# EAGLE design rp2040BOY (EAGLE 9.6.2)
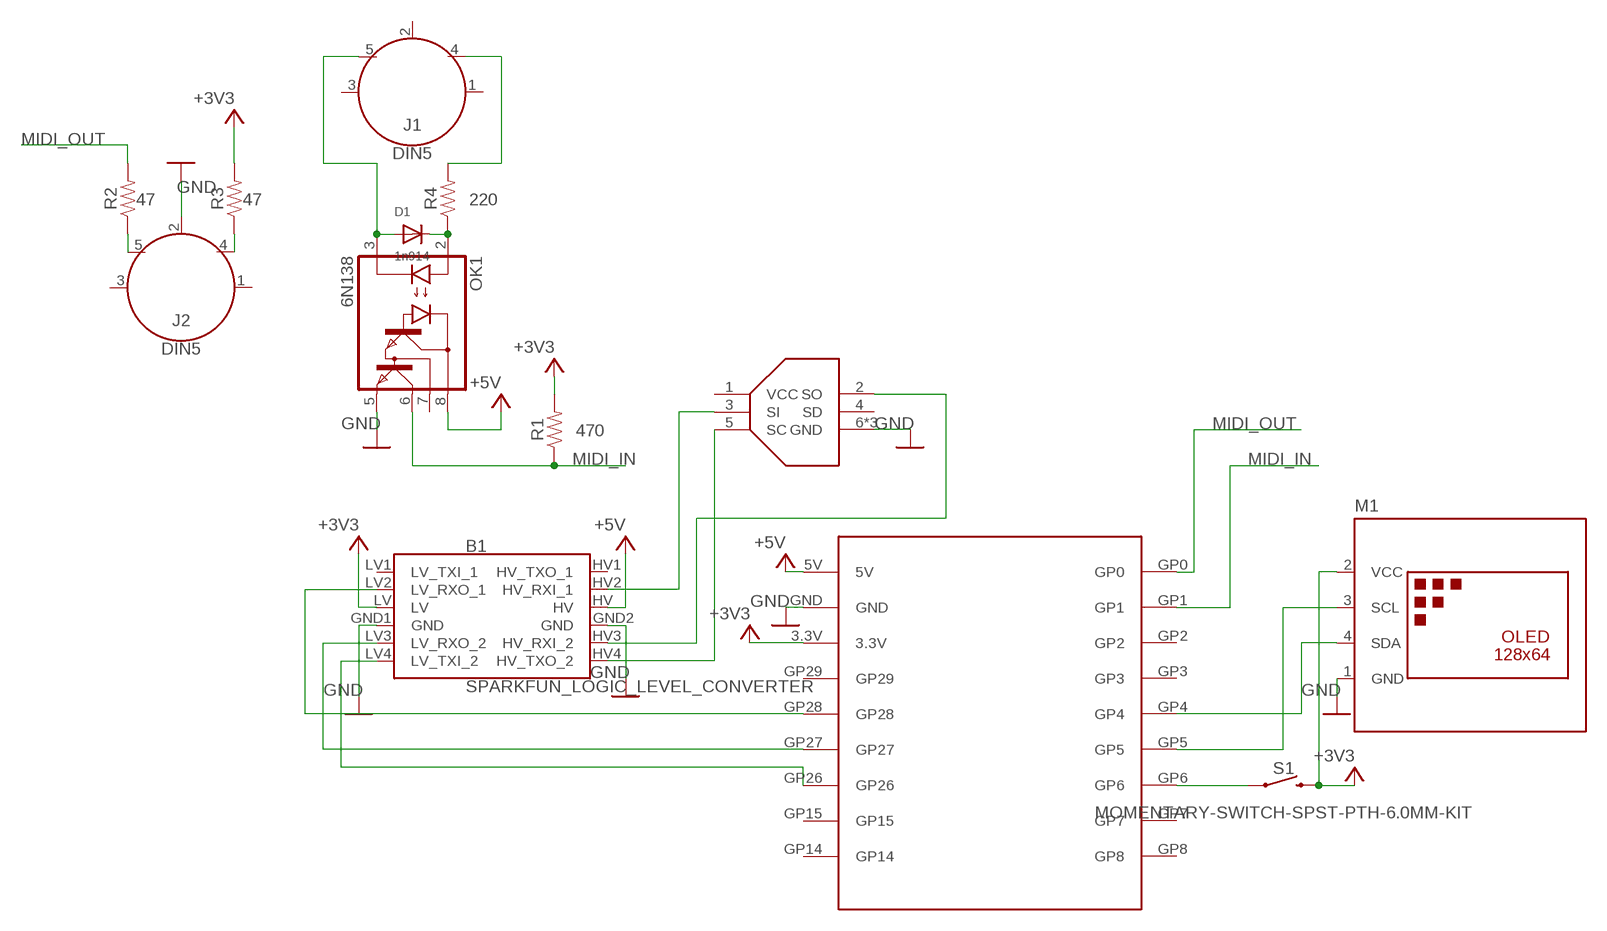
[diagram p0: schematic, sheet 1]

## Parts
B1  SPARKFUN_LOGIC_LEVEL_CONVERTER  [SPARKFUN_LOGIC_LEVEL_CONVERTER]
D1  1n914  DIODEDO-1N4148  [DO-1N4148]
J1  DIN5  [DIN5-RA-PTH]
J2  DIN5  [DIN5-RA-PTH]
M1  OLED-128X64-I2C-NH  [DISPLAY-OLED-128X64-I2C_NH]
OK1  6N138  [DIL08]
R1  470  RESISTORAXIAL-0.3  [AXIAL-0.3]
R2  47  RESISTORAXIAL-0.3  [AXIAL-0.3]
R3  47  RESISTORAXIAL-0.3  [AXIAL-0.3]
R4  220  RESISTORAXIAL-0.3  [AXIAL-0.3]
S1  MOMENTARY-SWITCH-SPST-PTH-6.0MM-KIT  [TACTILE_SWITCH_PTH_6.0MM_KIT]
U$1  GBC_LINK_CONN  [GBC]
U$2  RP2040-ZERO-ROUND  [RP2040-ZERO_O]

## Nets
+3V3: B1.LV M1.2(VCC) R1.P$2 R3.P$2 S1.3 U$2.3.3V
+5V: B1.HV OK1.8(VCC) U$2.5V
GND: B1.GND1(GND) B1.GND2(GND) J2.2 M1.1(GND) OK1.5(GND) U$1.6(GND) U$1.P$7(GND) U$1.P$8(GND) U$2.GND
MIDI_IN: OK1.6(VO) R1.P$1 U$2.GP1
MIDI_OUT: R2.P$2 U$2.GP0
N$1: B1.LV4(LV_TXI_2) U$2.GP26
N$2: B1.LV3(LV_RXO_2) U$2.GP27
N$3: B1.LV2(LV_RXO_1) U$2.GP28
N$4: B1.HV3(HV_RXI_2) U$1.2(SO)
N$5: B1.HV2(HV_RXI_1) U$1.3(SI)
N$6: B1.HV4(HV_TXO_2) U$1.5(SC)
N$7: S1.1 U$2.GP6
N$8: M1.4(SDA) U$2.GP4
N$9: M1.3(SCL) U$2.GP5
N$10: D1.A J1.5 OK1.3(C)
N$11: D1.C OK1.2(A) R4.P$1
N$13: J2.5 R2.P$1
N$14: J2.4 R3.P$1
N$15: J1.4 R4.P$2
Unconnected: B1.HV1(HV_TXO_1) B1.LV1(LV_TXI_1) J1.1 J1.2 J1.3 J2.1 J2.3 OK1.7(VB) U$1.1(VCC) U$1.4(SD) U$2.GP2 U$2.GP3 U$2.GP7 U$2.GP8 U$2.GP14 U$2.GP15 U$2.GP29

## Library data of the parts
B1 = SparkFun-Boards:SPARKFUN_LOGIC_LEVEL_CONVERTER: SparkFun Logic Level Converter -Bi-Directional This is the mechnical outline for the 3.3V - 5V bi directional logic level converter. *Note, the "LOCK" Package has the header pins staggered by an offset of 5 mils (off center line), so that when you slide a row of standard 0.1" headers into the PTH pads, it will hold position vertically. See the follwing turorial for more information on this type of special footprints: Sneaky Footprints <https://www.sparkfun.com/tutorials/114> SparkFun Products: SparkFun Logic Level Converter - Bi-Directional <https://www.sparkfun.com/products/12009>
D1 = adafruit:DIODE: Diode SMADIODE - SMA Surface Mount Package 20V 1A Schottky Diode Digikey: 641-1014-6-ND DO-1N4148 - Through Hole Small Current Diode SOD-123 20V 1 A (.5mV Vf) Schottky Diode - Digikey: MBRX120TPMSCT-ND SOD-323 10V 570mA (.38mV Vf, 3ns) Schottky Diode - Digikey: ZLLS410CT-ND SOD-523 30V 30mA Schottky Diode (RB751S-40TE61) - Digikey: RB751S-40TE61CT-ND SOT23-R/W - SOT23 Package (R = Solder Paste/Reflow Ovens, W = Hand-Soldering) BAT54Film 40V 300mA - Digikey: 497-7162-1-ND
J1 J2 = SparkFun-Connectors:DIN5: DIN5 Connector - Female Right Angle (frequently used as a MIDI Jack connector) This type of connector and cable is frequently used for transmitting midi data (musical instrument digital interface). It is what you usually see on a keyboard or set of electronic drums. Learn more here <https://en.wikipedia.org/wiki/MIDI>. For more information on the pinout and electrical specifications of MIDI communications, please see the following resource: https://www.midi.org/specifications/item/midi-din-electrical-specification Here is the connector we sell at SparkFun: MIDI Connector - Female Right Angle <https://www.sparkfun.com/products/9536> (PRT-09536) Datasheet <hhttp://www.sparkfun.com/datasheets/Prototyping/Connectors/MIDI-RA.pdf> It is used on this SparkFun product: SparkFun MIDI Shield <https://www.sparkfun.com/products/12898> (DEV-12898); PROD_ID: CONN-09481
M1 = MCE_Displays:OLED-128X64-I2C: 128x64 Dot Matrix OLED Module based on SSD1306/SSD1309 chip Variant with I2C interface
OK1 = optocoupler:6N138: MOTOROLA OPTO COUPLER; MF: VISHAY/TELEFUNKEN; MPN: 6N138; OC_FARNELL: 9860150; OC_NEWARK: 35K5294
R1-R4 = SparkFun-Resistors:RESISTOR: Generic Resistor Package
S1 = SparkFun-Switches:MOMENTARY-SWITCH-SPST: Momentary Switch (Pushbutton) - SPST Normally-open (NO) SPST momentary switches (buttons, pushbuttons). Variants PTH-12MM - 12mm square, through-hole Momentary Pushbutton Switch - 12mm Square <https://www.sparkfun.com/products/9190> (COM-09190) PTH-6.0MM, PTH-6.0MM-KIT - 6.0mm square, through-hole Mini Pushbutton Switch <https://www.sparkfun.com/products/97> (COM-00097) KIT package intended for soldering kit's - only one side of pads' copper is exposed. PTH-RIGHT-ANGLE-KIT - Right-angle, through-hole Right Angle Tactile Button <https://www.sparkfun.com/products/10791> - Used on SparkFun BigTime Watch Kit <https://www.sparkfun.com/products/11734> SMD-12MM - 12mm square, surface-mount Tactile Button - SMD (12mm) <https://www.sparkfun.com/products/12993> (COM-12993) Used on SparkFun PicoBoard <https://www.sparkfun.com/products/11888> SMD-4.5MM - 4.5mm Square Trackball Switch Used on SparkFun Blackberry Trackballer Breakout <https://www.sparkfun.com/products/13169> SMD-4.6MMX2.8MM - 4.60mm x 2.80mm, surface mount Used on SparkFun Pro Micro - RP2040 <https://www.sparkfun.com/products/17717> SMD-5.2MM, SMD-5.2-REDUNDANT - 5.2mm square, surface-mount Mini Pushbutton Switch - SMD <https://www.sparkfun.com/products/8720> (COM-08720) Used on Arduino Pro Mini <https://www.sparkfun.com/products/11114> REDUNDANT package connects both switch circuits together SMD-6.0X3.5MM - 6.0 x 3.5mm, surface mount Momentary Reset Switch SMD <https://www.sparkfun.com/products/8229> (COM-08229) SMD-6.2MM-TALL - 6.2mm square, surface mount Tactile Button - SMD (6mm) <https://www.sparkfun.com/products/12992> Used on SparkFun Digital Sandbox <https://www.sparkfun.com/products/12651> SMD-RIGHT-ANGLE - Right-angle, surface mount Used on SparkFun Block for Intel® Edison - Arduino <https://www.sparkfun.com/products/13036>; PROD_ID: SWCH-08441; SF_SKU: COM-00097
U$1 = gb_link_port:GBC_LINK_CONN
U$2 = RpiPico:RP2040-ZERO-ROUND

## Board
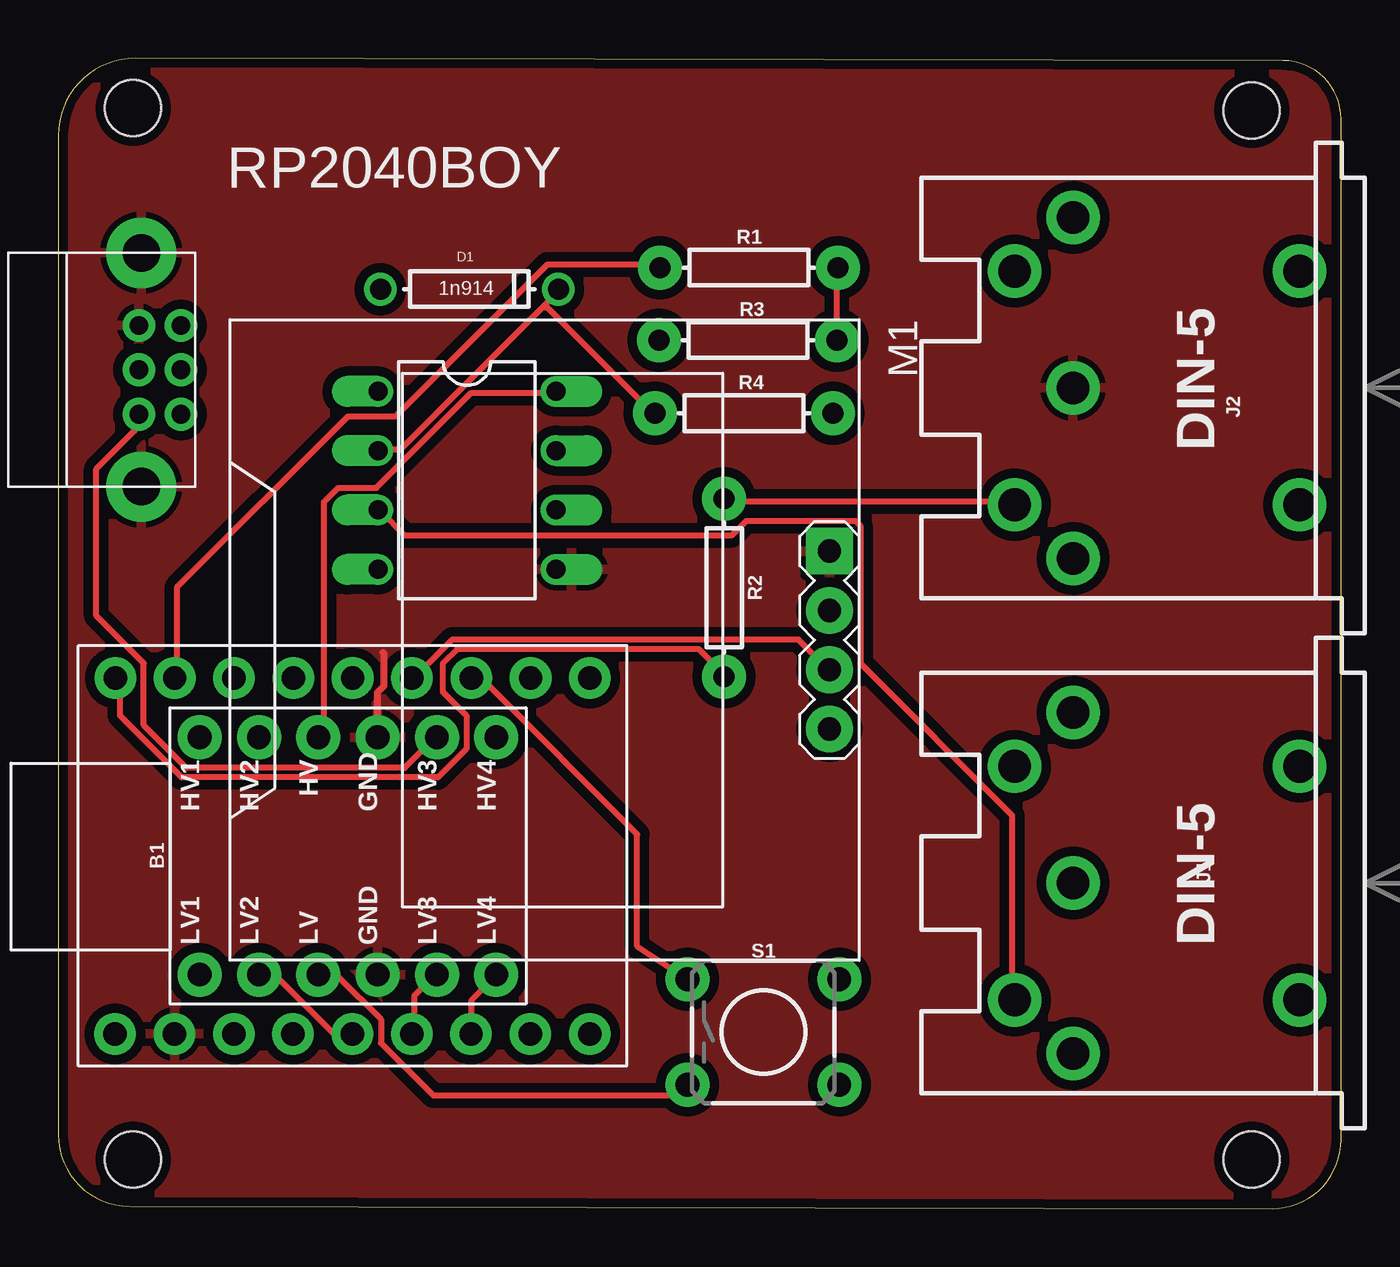
[diagram p1: board, top side]
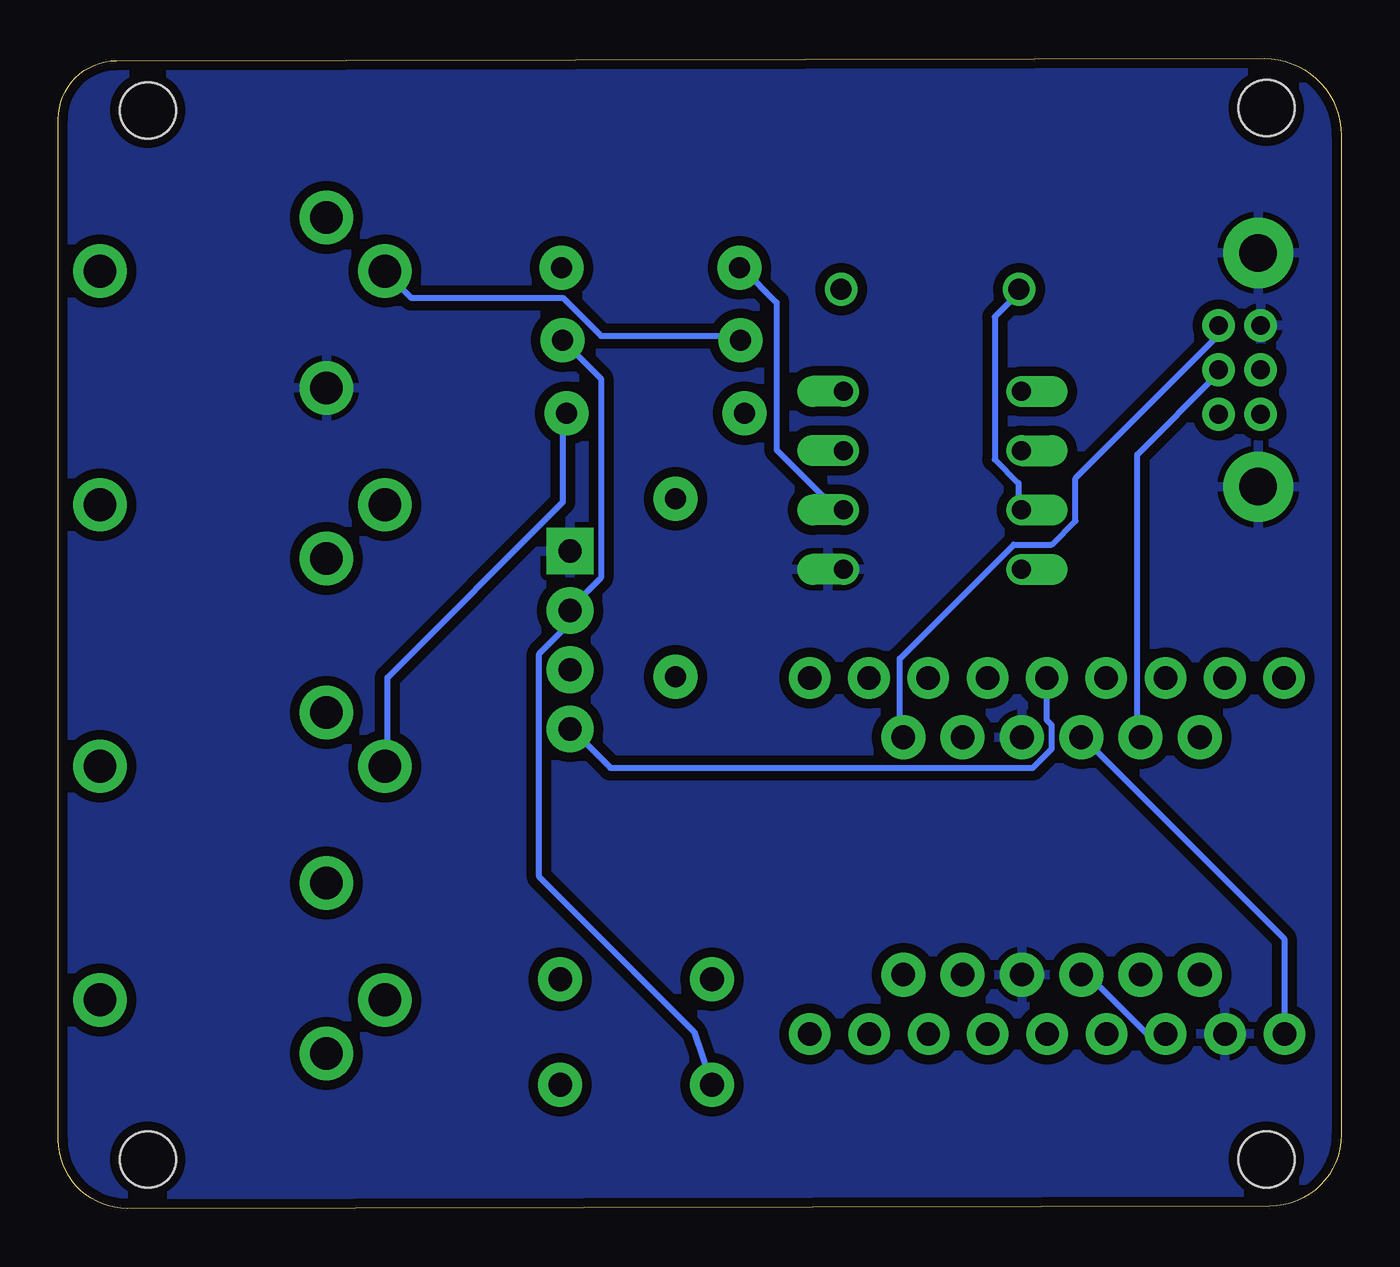
[diagram p2: board, bottom side, seen from below]

Size 54.93 x 49.23 mm. Coordinates in mm from the lower left corner, seen from the top.
Outline: 3.06,0.09 51.98,0 arc90 54.93,2.95 54.93,46.64 arc90 52.43,49.14 3.3,49.23 arc90 0,45.94 0,3.16 arc90 3.06,0.09
Copper layers (1*16): Top 0.035mm / dielectric 1.5mm / Bottom 0.035mm
Design rules "default *": minimum track width 10mil, minimum drill 0.35mm, track to track 6mil, track to pad 6mil, pad to pad 6mil, via to via 6mil, smd to smd 6mil, copper to edge 6mil, drill to drill 6mil, minimum pad ring 10mil, minimum via ring 8mil, stop-mask expansion 4mil, vias tented up to drill 0mil, thermal gap 10mil
Holes 2.4 mm at 51.1,47 51.1,2.1 3.2,2.1 3.2,47.1

### Footprints (pad centres in the part's own frame; a part is rotated, then mirrored left to right if it is on the bottom)
SPARKFUN_LOGIC_LEVEL_CONVERTER = drill 1.016 pad 1.88: GND1 -5.08,-1.27; GND2 5.08,-1.27; HV 5.08,1.27; HV1 5.08,6.35; HV2 5.08,3.81; HV3 5.08,-3.81; HV4 5.08,-6.35; LV -5.08,1.27; LV1 -5.08,6.35; LV2 -5.08,3.81; LV3 -5.08,-3.81; LV4 -5.08,-6.35
DO-1N4148 = drill 0.9: A -3.81,0; C 3.81,0
DIN5-RA-PTH = drill 1.4 pad 2.286: 1 7.3,12.5; 2 0,12.5; 3 -7.3,12.5; 4 5,15; 5 -5,15; 6 -5,2.8; 7 5,2.8
DISPLAY-OLED-128X64-I2C_NH = drill 1 pad 2 square: 1 -3.81,12.7 | drill 1 pad 2: 2 -1.27,12.7; 3 1.27,12.7; 4 3.81,12.7
DIL08 = drill 0.813 offset: 1 -3.81,-3.81; 2 -1.27,-3.81; 3 1.27,-3.81; 4 3.81,-3.81; 5 3.81,3.81; 6 1.27,3.81; 7 -1.27,3.81; 8 -3.81,3.81
AXIAL-0.3 = drill 0.9 pad 1.88: P$1 -3.81,0; P$2 3.81,0
TACTILE_SWITCH_PTH_6.0MM_KIT = drill 1.016 pad 1.88: 1 -3.251,2.261; 2 3.251,2.261; 3 -3.251,-2.261; 4 3.251,-2.261
GBC = drill 0.8 pad 1.4: 1 3.1,0.6; 2 3.1,2.4; 3 5,0.6; 4 5,2.4; 5 6.9,0.6; 6 6.9,2.4 | drill 1.6 pad 3: P$7 10,2.3; P$8 0,2.3
RP2040-ZERO_O = drill 1 pad 1.778: 3.3V -7.62,5.09; 5V -7.62,10.17; GND -7.62,7.63; GP0 7.62,10.16; GP1 7.62,7.62; GP2 7.62,5.08; GP3 7.62,2.54; GP4 7.62,0; GP5 7.62,-2.54; GP6 7.62,-5.08; GP7 7.62,-7.62; GP8 7.62,-10.16; GP14 -7.62,-10.15; GP15 -7.62,-7.61; GP26 -7.62,-5.07; GP27 -7.62,-2.53; GP28 -7.62,0.01; GP29 -7.62,2.55

### Placement (x,y rotation side)
B1  12.4,15.09 90 top
D1  17.6,39.35 0 top
J1  55.95,13.93 90 top
J2  55.95,35.12 90 top
M1  20.32,24.33 270 top
OK1  17.5,31.17 270 top
R1  29.57,40.27 0 top
R2  28.51,26.57 270 top
R3  29.53,37.17 0 top
R4  29.36,34.04 0 top
S1  30.19,7.55 0 top
U$1  5.85,30.9 90 top
U$2  12.6,15.09 90 top

### Tracks (layer width: path | path; a pad name or v marks a point on that pad's centre or on a via)
+3V3
  Top 0.254: R3.P$2 33.32,37.36 33.32,40.2 R1.P$2 | S1.3 26.49,4.84 16.05,4.84 13.81,7.08 13.81,8.1 11.99,9.92 11.17,9.92 B1.LV
  Bottom 0.254: R3.P$2 33.32,37.15 31.7,35.53 31.7,26.99 32.92,25.77 M1.2 33.12,25.57 33.12,24.96 34.34,23.74 34.34,14.19 27.72,7.57 S1.3 | U$2.3.3V 7.52,7.49 8.33,7.49 10.97,10.13 B1.LV
+5V
  Top 0.254: OK1.8 21.13,34.92 17.68,34.92 13.61,30.85 11.99,30.85 11.38,30.24 11.38,20.49 11.17,20.29 B1.HV
  Bottom 0.254: U$2.5V 2.44,7.49 2.44,11.55 10.97,20.08 B1.HV
GND
  Top 0.305: B1.GND2 13.67,22.1 13.95,22.37 13.95,23.76 13.9,23.8
  pour Bottom (isolate 0.406): -1.5,52.1 60,52.1 60.2,52.3 60.2,-3 60.3,-3.1 -2.3,-3.1 -2.3,51.3
  pour Top (isolate 0.406): -3.7,54.3 61.4,54.3 63.8,51.9 63.8,-1.8 60.6,-5 -2.2,-5 -4.9,-2.3 -4.9,53.1
MIDI_IN
  Top 0.254: U$2.GP1 5.08,22.73 5.08,26.59 12.39,33.9 14.42,33.9 20.93,40.4 25.6,40.4 R1.P$1
  Bottom 0.254: OK1.6 21.33,30.04 21.74,30.04 24.18,32.48 24.18,38.78 25.6,40.2 R1.P$1
MIDI_OUT
  Top 0.254: U$2.GP0 2.64,22.52 2.64,21.1 5.28,18.46 16.25,18.46 17.47,19.68 17.47,21.1 16.46,22.12 16.46,23.34 17.07,23.95 27.43,23.95 28.45,22.93 R2.P$2
N$1
  Top 0.254: U$2.GP26 17.68,7.49 17.68,8.91 18.69,9.92 B1.LV4
N$2
  Top 0.254: U$2.GP27 15.24,7.49 15.24,9.11 16.05,9.92 B1.LV3
N$3
  Top 0.254: U$2.GP28 12.39,7.49 11.78,7.49 9.34,9.92 8.73,9.92 B1.LV2
N$4
  Top 0.254: U$1.2 3.25,33.9 3.25,33.29 1.62,31.67 1.62,25.37 3.65,23.34 3.65,20.69 5.48,18.87 14.83,18.87 16.05,20.08 B1.HV3
N$5
  Bottom 0.254: U$1.3 5.28,35.73 8.73,32.28 8.73,20.29 B1.HV2
N$6
  Bottom 0.254: U$1.5 5.28,37.76 5.28,37.36 11.38,31.26 11.38,29.43 12.39,28.42 14.02,28.42 18.89,23.54 18.89,20.29 B1.HV4
N$7
  Top 0.254: U$2.GP6 17.88,22.52 18.29,22.52 24.79,16.02 24.79,11.23 S1.1
N$8
  Bottom 0.254: U$2.GP4 12.59,22.52 12.59,20.9 12.39,20.69 12.39,19.68 13.21,18.87 31.29,18.87 32.92,20.49 M1.4
N$9
  Top 0.254: U$2.GP5 15.24,22.73 16.86,24.35 31.7,24.35 32.92,23.13 M1.3
N$10
  Top 0.254: J1.5 40.84,9.11 40.84,16.83 34.34,23.34 34.34,29.23 34.13,29.43 29.46,29.43 28.85,28.82 14.83,28.82 13.81,29.84 OK1.3
  Bottom 0.254: OK1.3 13.81,30.04 13.81,31.06 14.83,32.07 14.83,38.17 13.81,39.19 D1.A
N$11
  Top 0.254: 20.72,38.58 21.33,39.19 D1.C | 20.72,38.58 14.63,32.48 13.81,32.48 OK1.2 | 20.72,38.58 20.93,38.58 25.4,34.11 R4.P$1
N$13
  Top 0.254: R2.P$1 28.65,30.24 40.84,30.24 J2.5
N$14
  Bottom 0.254: R3.P$1 25.8,37.36 31.7,37.36 33.32,38.98 39.82,38.98 40.84,40 J2.4
N$15
  Bottom 0.254: R4.P$2 33.32,33.9 33.32,30.24 40.84,22.73 40.84,19.07 J1.4

### Text on the board
tPlace: RP2040BOY